# EAGLE design schematic (EAGLE 9.2.2)
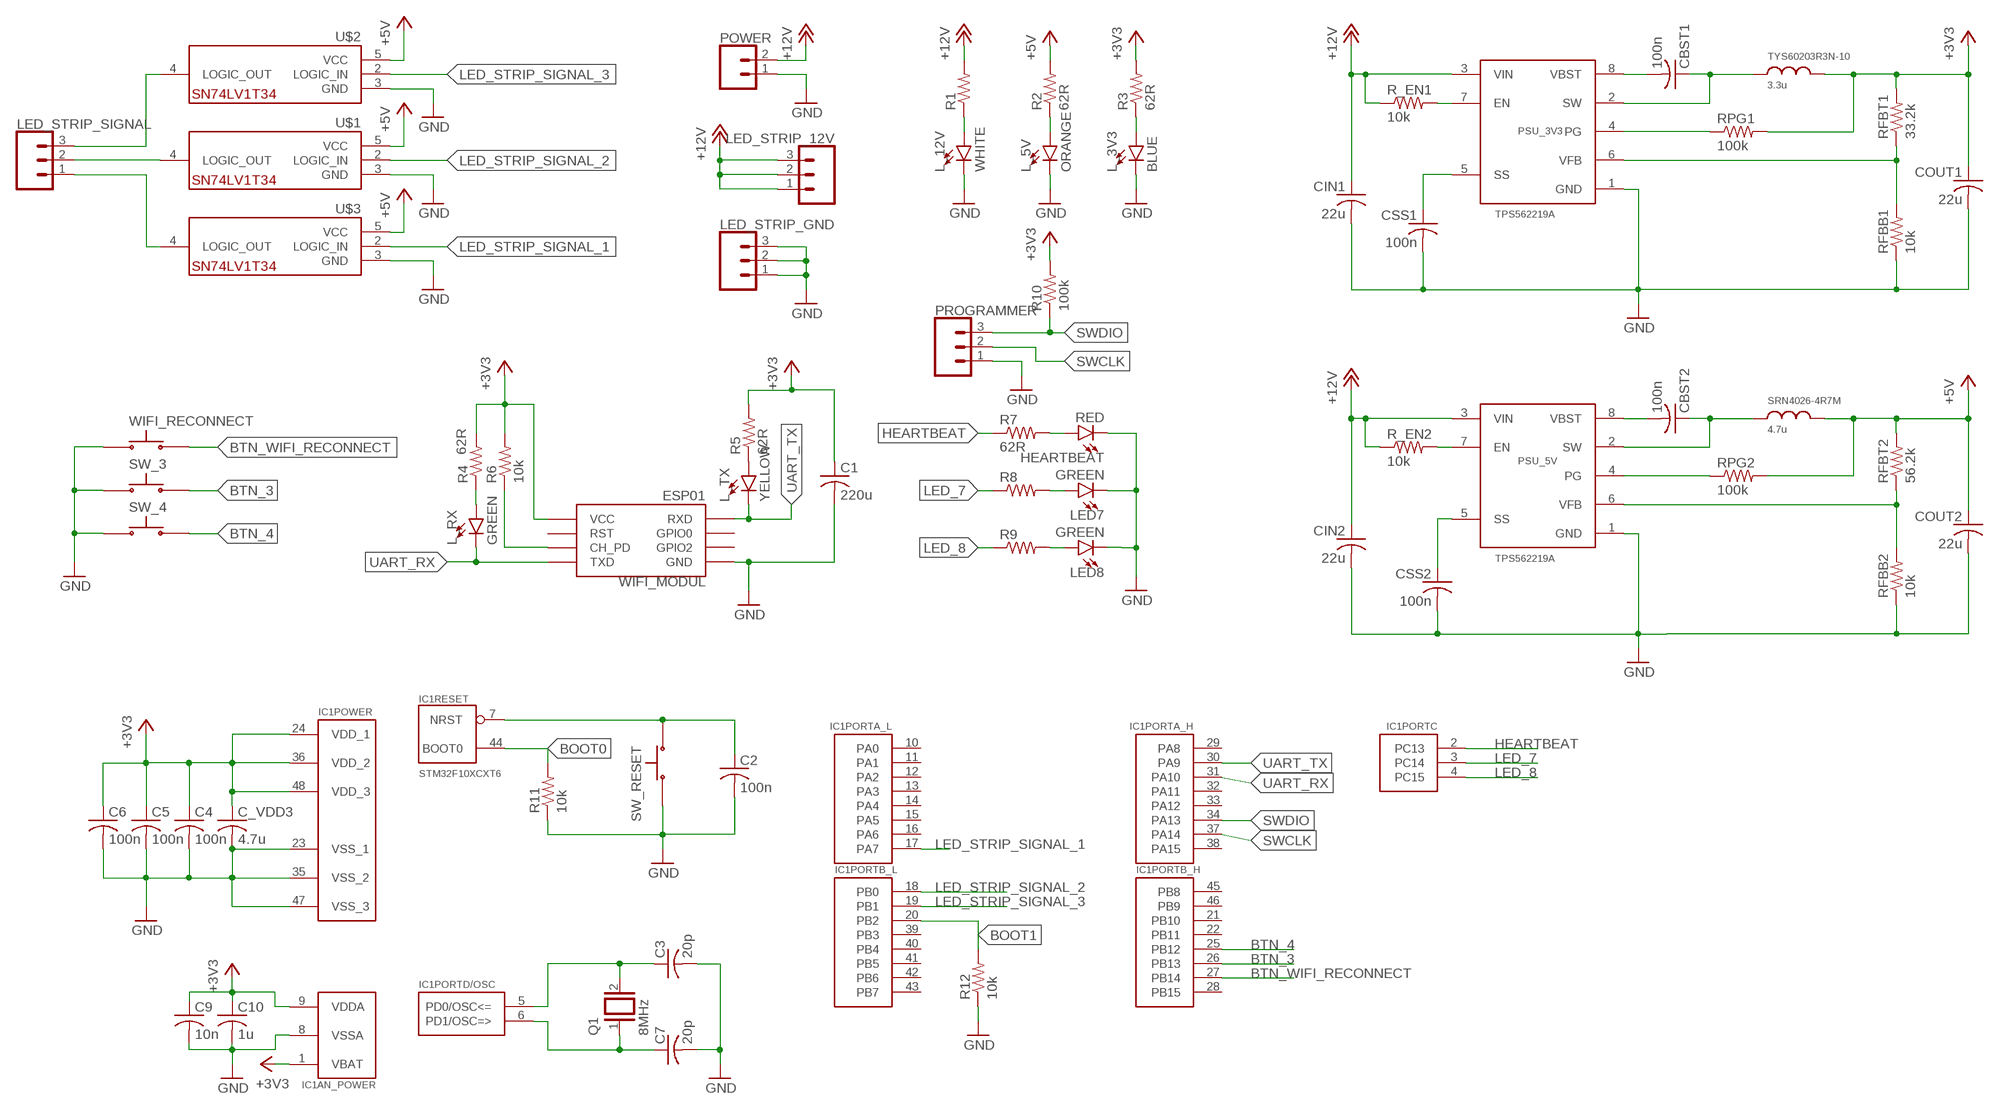
[diagram p0: schematic, sheet 1]

## Parts
C1  220u  C-USC1206  [C1206]
C2  100n  C-USC1206  [C1206]
C3  20p  C-USC1206  [C1206]
C4  100n  C-USC1206  [C1206]
C5  100n  C-USC1206  [C1206]
C6  100n  C-USC1206  [C1206]
C7  20p  C-USC1206  [C1206]
C9  10n  C-USC1206  [C1206]
C10  1u  C-USC1206  [C1206]
C_VDD3  4.7u  C-USC1206  [C1206]
CBST1  100n  C-USC1206  [C1206]
CBST2  100n  C-USC1206  [C1206]
CIN1  22u  C-USC1206  [C1206]
CIN2  22u  C-USC1206  [C1206]
COUT1  22u  C-USC1206  [C1206]
COUT2  22u  C-USC1206  [C1206]
CSS1  100n  C-USC1206  [C1206]
CSS2  100n  C-USC1206  [C1206]
HEARTBEAT  RED  LED-GREEN1206  [LED-1206]
IC1  STM32F10XCXT6  [TQFP48]
L_3V3  BLUE  LED-GREEN1206  [LED-1206]
L_5V  ORANGE  LED-GREEN1206  [LED-1206]
L_12V  WHITE  LED-GREEN1206  [LED-1206]
L_RX  GREEN  LED-GREEN1206  [LED-1206]
L_TX  YELLOW  LED-GREEN1206  [LED-1206]
LED7  GREEN  LED-GREEN1206  [LED-1206]
LED8  GREEN  LED-GREEN1206  [LED-1206]
LED_STRIP_12V  CONN_03SCREW  [SCREWTERMINAL-3.5MM-3]
LED_STRIP_GND  CONN_03SCREW  [SCREWTERMINAL-3.5MM-3]
LED_STRIP_SIGNAL  CONN_03SCREW  [SCREWTERMINAL-3.5MM-3]
POWER  CONN_025MM  [SCREWTERMINAL-5MM-2]
PROGRAMMER  CONN_03POLAR  [MOLEX-1X3]
PSU_3V3  TPS562219A  [SOT23-8L]
PSU_5V  TPS562219A  [SOT23-8L]
Q1  8MHz  XTAL/S  [QS]
R1  R-US_R1206  [R1206]
R2  62R  R-US_R1206  [R1206]
R3  62R  R-US_R1206  [R1206]
R4  62R  R-US_R1206  [R1206]
R5  62R  R-US_R1206  [R1206]
R6  10k  R-US_R1206  [R1206]
R7  62R  R-US_R1206  [R1206]
R8  R-US_R1206  [R1206]
R9  R-US_R1206  [R1206]
R10  100k  R-US_R1206  [R1206]
R11  10k  R-US_R1206  [R1206]
R12  10k  R-US_R1206  [R1206]
R_EN1  10k  R-US_R1206  [R1206]
R_EN2  10k  R-US_R1206  [R1206]
RFBB1  10k  R-US_R1206  [R1206]
RFBB2  10k  R-US_R1206  [R1206]
RFBT1  33.2k  R-US_R1206  [R1206]
RFBT2  56.2k  R-US_R1206  [R1206]
RPG1  100k  R-US_R1206  [R1206]
RPG2  100k  R-US_R1206  [R1206]
SRN4026-4R7M  4.7u  SRN4026-4R7M  [SRN4026-4R7M]
SW_3  TACTILE_SWITCH_SIDETACTILE_SWITCH_SIDE  [TACTILE_SWITCH_SIDE]
SW_4  TACTILE_SWITCH_SIDETACTILE_SWITCH_SIDE  [TACTILE_SWITCH_SIDE]
SW_RESET  TACTILE_SWITCH_SIDETACTILE_SWITCH_SIDE  [TACTILE_SWITCH_SIDE]
TYS60203R3N-10  3.3u  TYS60203R3N-10  [TYS60203R3N-10]
U$1  SN74LV1T34  [SOT-23-5]
U$2  SN74LV1T34  [SOT-23-5]
U$3  SN74LV1T34  [SOT-23-5]
WIFI_MODUL  ESP01  [ESP01]
WIFI_RECONNECT  TACTILE_SWITCH_SIDETACTILE_SWITCH_SIDE  [TACTILE_SWITCH_SIDE]

## Nets
+3V3: C1.1 C4.1 C5.1 C6.1 C9.1 C10.1 C_VDD3.1 COUT1.1 IC1.1(AN_POWER:VBAT) IC1.9(AN_POWER:VDDA) IC1.24(POWER:VDD_1) IC1.36(POWER:VDD_2) IC1.48(POWER:VDD_3) R3.2 R4.2 R5.2 R6.2 R10.2 RFBT1.2 RPG1.2 TYS60203R3N-10.P$2 WIFI_MODUL.VCC
+5V: COUT2.1 R2.2 RFBT2.2 RPG2.2 SRN4026-4R7M.P$3 U$1.5(VCC) U$2.5(VCC) U$3.5(VCC)
+12V: CIN1.1 CIN2.1 LED_STRIP_12V.1 LED_STRIP_12V.2 LED_STRIP_12V.3 POWER.2 PSU_3V3.3(VIN) PSU_5V.3(VIN) R1.2 R_EN1.1 R_EN2.1
BOOT0: IC1.44(RESET:BOOT0) R11.2
BOOT1: IC1.20(PORTB_L:PB2) R12.2
BTN_3: IC1.26(PORTB_H:PB13) SW_3.P$5
BTN_4: IC1.25(PORTB_H:PB12) SW_4.P$5
BTN_WIFI_RECONNECT: IC1.27(PORTB_H:PB14) WIFI_RECONNECT.P$5
GND: C1.2 C2.2 C3.2 C4.2 C5.2 C6.2 C7.2 C9.2 C10.2 C_VDD3.2 CIN1.2 CIN2.2 COUT1.2 COUT2.2 CSS1.2 CSS2.2 HEARTBEAT.C IC1.8(AN_POWER:VSSA) IC1.23(POWER:VSS_1) IC1.35(POWER:VSS_2) IC1.47(POWER:VSS_3) L_3V3.C L_5V.C L_12V.C LED7.C LED8.C LED_STRIP_GND.1 LED_STRIP_GND.2 LED_STRIP_GND.3 POWER.1 PROGRAMMER.1 PSU_3V3.1(GND) PSU_5V.1(GND) R11.1 R12.1 RFBB1.1 RFBB2.1 SW_3.P$3 SW_4.P$3 SW_RESET.P$5 U$1.3(GND) U$2.3(GND) U$3.3(GND) WIFI_MODUL.GND WIFI_RECONNECT.P$3
HEARTBEAT: IC1.2(PORTC:PC13) R7.1
LED_7: IC1.3(PORTC:PC14) R8.1
LED_8: IC1.4(PORTC:PC15) R9.1
LED_STRIP_SIGNAL_1: IC1.17(PORTA_L:PA7) U$3.2(LOGIC_IN)
LED_STRIP_SIGNAL_2: IC1.18(PORTB_L:PB0) U$1.2(LOGIC_IN)
LED_STRIP_SIGNAL_3: IC1.19(PORTB_L:PB1) U$2.2(LOGIC_IN)
N$1: LED_STRIP_SIGNAL.3 U$2.4(LOGIC_OUT)
N$2: LED_STRIP_SIGNAL.2 U$1.4(LOGIC_OUT)
N$3: LED_STRIP_SIGNAL.1 U$3.4(LOGIC_OUT)
N$4: L_12V.A R1.1
N$5: L_5V.A R2.1
N$6: L_3V3.A R3.1
N$7: L_RX.A R4.1
N$8: R6.1 WIFI_MODUL.CH_PD
N$9: L_TX.A R5.1
N$10: HEARTBEAT.A R7.2
N$11: LED7.A R8.2
N$12: LED8.A R9.2
N$13: C2.1 IC1.7(RESET:NRST) SW_RESET.P$3
N$14: C3.1 IC1.5(PORTD/OSC:PD0/OSC<=) Q1.2
N$15: C7.1 IC1.6(PORTD/OSC:PD1/OSC=>) Q1.1
N$17: CBST1.2 PSU_3V3.8(VBST)
N$26: CBST1.1 PSU_3V3.2(SW) TYS60203R3N-10.P$1
N$31: CBST2.2 PSU_5V.8(VBST)
N$32: PSU_3V3.6(VFB) RFBB1.2 RFBT1.1
N$33: CBST2.1 PSU_5V.2(SW) SRN4026-4R7M.P$2
N$35: PSU_5V.6(VFB) RFBB2.2 RFBT2.1
N$37: PSU_3V3.7(EN) R_EN1.2
N$38: PSU_5V.7(EN) R_EN2.2
N$PG1: PSU_3V3.4(PG) RPG1.1
N$PG2: PSU_5V.4(PG) RPG2.1
N$SS1: CSS1.1 PSU_3V3.5(SS)
N$SS2: CSS2.1 PSU_5V.5(SS)
SWCLK: IC1.37(PORTA_H:PA14) PROGRAMMER.2
SWDIO: IC1.34(PORTA_H:PA13) PROGRAMMER.3 R10.1
UART_RX: IC1.31(PORTA_H:PA10) L_RX.C WIFI_MODUL.TX(TXD)
UART_TX: IC1.30(PORTA_H:PA9) L_TX.C WIFI_MODUL.RX(RXD)
Unconnected: IC1.10(PORTA_L:PA0) IC1.11(PORTA_L:PA1) IC1.12(PORTA_L:PA2) IC1.13(PORTA_L:PA3) IC1.14(PORTA_L:PA4) IC1.15(PORTA_L:PA5) IC1.16(PORTA_L:PA6) IC1.21(PORTB_H:PB10) IC1.22(PORTB_H:PB11) IC1.28(PORTB_H:PB15) IC1.29(PORTA_H:PA8) IC1.32(PORTA_H:PA11) IC1.33(PORTA_H:PA12) IC1.38(PORTA_H:PA15) IC1.39(PORTB_L:PB3) IC1.40(PORTB_L:PB4) IC1.41(PORTB_L:PB5) IC1.42(PORTB_L:PB6) IC1.43(PORTB_L:PB7) IC1.45(PORTB_H:PB8) IC1.46(PORTB_H:PB9) WIFI_MODUL.GPIO0 WIFI_MODUL.GPIO2 WIFI_MODUL.RST

## Library data of the parts
C1-C7 C9 C10 C_VDD3 CBST1 CBST2 CIN1 CIN2 COUT1 COUT2 CSS1 CSS2 = rcl:C-US: CAPACITOR, American symbol; SPICEPREFIX: C
HEARTBEAT L_3V3 L_5V L_12V L_TX = SparkFun-LED:LED-GREEN: Green SMD LED Used in manufacturing of various products at SparkFun Packages: 0603 - SMD 0603 package [Product Link] <http://www.futureelectronics.com/en/technologies/semiconductors/optoelectronics/leds/Pages/9894312-LTST-C190GKT.aspx?CrossPart=HSMG-C190&IM=0> LilyPad 1206 - SMD1206 LilyPad package [Product Link] <http://www.futureelectronics.com/en/Technologies/Product.aspx?ProductID=IN150NGHARVATEKCORPORATION2049943&IM=0> 1206 - SMD1206 package [Product Link] <http://www.futureelectronics.com/en/technologies/semiconductors/optoelectronics/leds/Pages/8315665-LTST-C150KGKT.aspx?IM=0> 1206 Bottom Mount -SMD 1206 Bottom Mount [Product Link] <http://www.digikey.com/product-detail/en/lite-on-inc/LTST-C230KGKT/160-1456-1-ND/386854> SparkFun Products: Pro Mini 328 -5V <https://www.sparkfun.com/products/821> RedBoard <https://www.sparkfun.com/products/12757> MP3 Trigger <https://www.sparkfun.com/products/13720> Makey Makey <https://www.sparkfun.com/products/11076>; PROD_ID: DIO-00862; VALUE: GREEN
IC1 = stm32:STM32F10XCXT6: ST STM32F101/103 48pin LQFP
L_RX LED7 LED8 = SparkFun-LED:LED-GREEN: Green SMD LED Used in manufacturing of various products at SparkFun Packages: 0603 - SMD 0603 package [Product Link] <http://www.futureelectronics.com/en/technologies/semiconductors/optoelectronics/leds/Pages/9894312-LTST-C190GKT.aspx?CrossPart=HSMG-C190&IM=0> LilyPad 1206 - SMD1206 LilyPad package [Product Link] <http://www.futureelectronics.com/en/Technologies/Product.aspx?ProductID=IN150NGHARVATEKCORPORATION2049943&IM=0> 1206 - SMD1206 package [Product Link] <http://www.futureelectronics.com/en/technologies/semiconductors/optoelectronics/leds/Pages/8315665-LTST-C150KGKT.aspx?IM=0> 1206 Bottom Mount -SMD 1206 Bottom Mount [Product Link] <http://www.digikey.com/product-detail/en/lite-on-inc/LTST-C230KGKT/160-1456-1-ND/386854> SparkFun Products: Pro Mini 328 -5V <https://www.sparkfun.com/products/821> RedBoard <https://www.sparkfun.com/products/12757> MP3 Trigger <https://www.sparkfun.com/products/13720> Makey Makey <https://www.sparkfun.com/products/11076>; PROD_ID: DIO-00862
LED_STRIP_12V LED_STRIP_GND LED_STRIP_SIGNAL = SparkFun-Connectors:CONN_03: Multi connection point. Often used as Generic Header-pin footprint for 0.1 inch spaced/style header connections On any of the 0.1 inch spaced packages, you can populate with these: Break Away Headers - Straight <https://www.sparkfun.com/products/116> (PRT-00116) Break Away Male Headers - Right Angle <https://www.sparkfun.com/products/553> (PRT-00553) Female Headers <https://www.sparkfun.com/products/115> (PRT-00115) Break Away Headers - Machine Pin <https://www.sparkfun.com/products/117> (PRT-00117) Break Away Female Headers - Swiss Machine Pin <https://www.sparkfun.com/products/743> (PRT-00743) Stackable Header - 3 Pin (Female, 0.1") <https://www.sparkfun.com/products/13875> (PRT-13875) For SCREWTERMINALS and SPRING TERMINALS visit here: Screw Terimnals on SparkFun.com <https://www.sparkfun.com/search/results?term=Screw+Terminals> (5mm/3.5mm/2.54mm spacing) This device is also useful as a general connection point to wire up your design to another part of your project. Our various solder wires solder well into these plated through hole pads. Hook-Up Wire - Assortment (Stranded, 22 AWG) <https://www.sparkfun.com/products/11375> (PRT-11375) Hook-Up Wire - Assortment (Solid Core, 22 AWG) <https://www.sparkfun.com/products/11367> (PRT-11367) View the entire wire category on our website here <https://www.sparkfun.com/categories/141> Special notes: Molex polarized connector foot print use with SKU : PRT-08232 with associated crimp pins and housings.; PROD_ID: CONN-08288; SF_ID: PRT-08235
POWER = SparkFun-Connectors:CONN_02: Multi connection point. Often used as Generic Header-pin footprint for 0.1 inch spaced/style header connections On any of the 0.1 inch spaced packages, you can populate with these: Break Away Headers - Straight <https://www.sparkfun.com/products/116> (PRT-00116) Break Away Male Headers - Right Angle <https://www.sparkfun.com/products/553> (PRT-00553) Female Headers <https://www.sparkfun.com/products/115> (PRT-00115) Break Away Headers - Machine Pin <https://www.sparkfun.com/products/117> (PRT-00117) Break Away Female Headers - Swiss Machine Pin <https://www.sparkfun.com/products/743> (PRT-00743) For SCREWTERMINALS and SPRING TERMINALS visit here: Screw Terimnals on SparkFun.com <https://www.sparkfun.com/search/results?term=Screw+Terminals> (5mm/3.5mm/2.54mm spacing) This device is also useful as a general connection point to wire up your design to another part of your project. Our various solder wires solder well into these plated through hole pads. Hook-Up Wire - Assortment (Stranded, 22 AWG) <https://www.sparkfun.com/products/11375> (PRT-11375) Hook-Up Wire - Assortment (Solid Core, 22 AWG) <https://www.sparkfun.com/products/11367> (PRT-11367) View the entire wire category on our website here <https://www.sparkfun.com/categories/141> Special notes: Molex polarized connector foot print use with: PRT-08233 with associated crimp pins and housings. 2.54_SCREWTERM for use with PRT-10571. 3.5mm Screw Terminal footprints for PRT-08084 5mm Screw Terminal footprints for use with PRT-08432; SF_SKU: PRT-08432
PROGRAMMER = SparkFun-Connectors:CONN_03: Multi connection point. Often used as Generic Header-pin footprint for 0.1 inch spaced/style header connections On any of the 0.1 inch spaced packages, you can populate with these: Break Away Headers - Straight <https://www.sparkfun.com/products/116> (PRT-00116) Break Away Male Headers - Right Angle <https://www.sparkfun.com/products/553> (PRT-00553) Female Headers <https://www.sparkfun.com/products/115> (PRT-00115) Break Away Headers - Machine Pin <https://www.sparkfun.com/products/117> (PRT-00117) Break Away Female Headers - Swiss Machine Pin <https://www.sparkfun.com/products/743> (PRT-00743) Stackable Header - 3 Pin (Female, 0.1") <https://www.sparkfun.com/products/13875> (PRT-13875) For SCREWTERMINALS and SPRING TERMINALS visit here: Screw Terimnals on SparkFun.com <https://www.sparkfun.com/search/results?term=Screw+Terminals> (5mm/3.5mm/2.54mm spacing) This device is also useful as a general connection point to wire up your design to another part of your project. Our various solder wires solder well into these plated through hole pads. Hook-Up Wire - Assortment (Stranded, 22 AWG) <https://www.sparkfun.com/products/11375> (PRT-11375) Hook-Up Wire - Assortment (Solid Core, 22 AWG) <https://www.sparkfun.com/products/11367> (PRT-11367) View the entire wire category on our website here <https://www.sparkfun.com/categories/141> Special notes: Molex polarized connector foot print use with SKU : PRT-08232 with associated crimp pins and housings.; PROD_ID: CONN-08625; SF_ID: PRT-08096
PSU_3V3 PSU_5V = mylibrary:TPS562219A
Q1 = special:XTAL/S: CRYSTAL
R1-R12 R_EN1 R_EN2 RFBB1 RFBB2 RFBT1 RFBT2 RPG1 RPG2 = rcl:R-US_: RESISTOR, American symbol; SPICEPREFIX: R
SRN4026-4R7M = mylibrary:SRN4026-4R7M
SW_3 SW_4 SW_RESET WIFI_RECONNECT = mylibrary:TACTILE_SWITCH_SIDE
TYS60203R3N-10 = mylibrary:TYS60203R3N-10
U$1 U$3 = mylibrary:SN74LV1T34
U$2 = mylibrary:SN74LV1T34; SPICEPREFIX: U
WIFI_MODUL = esp8266modules:ESP01: ESP8266 Wifi module 01

## Board
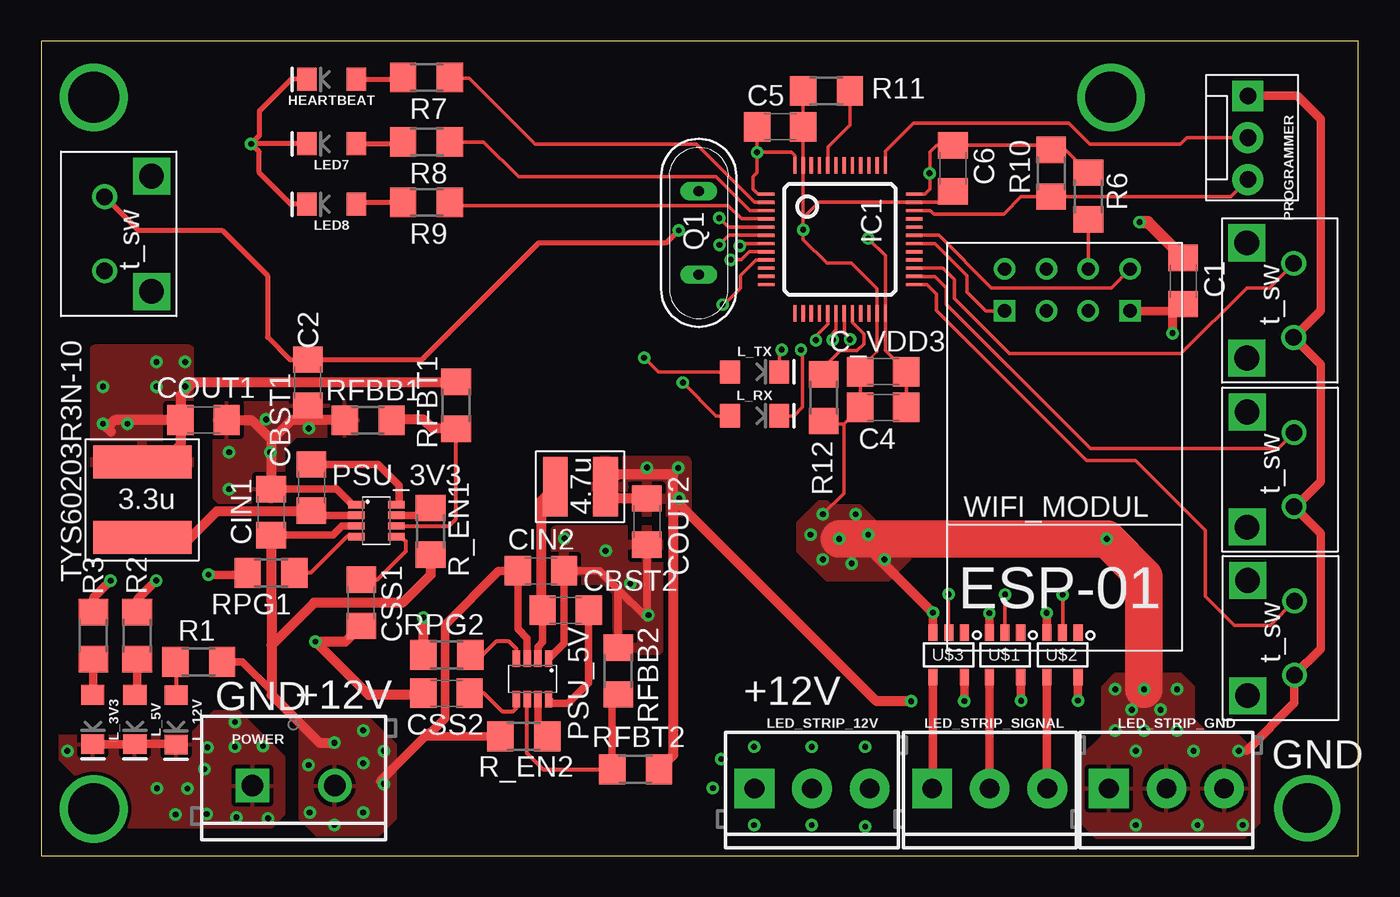
[diagram p1: board, top side]
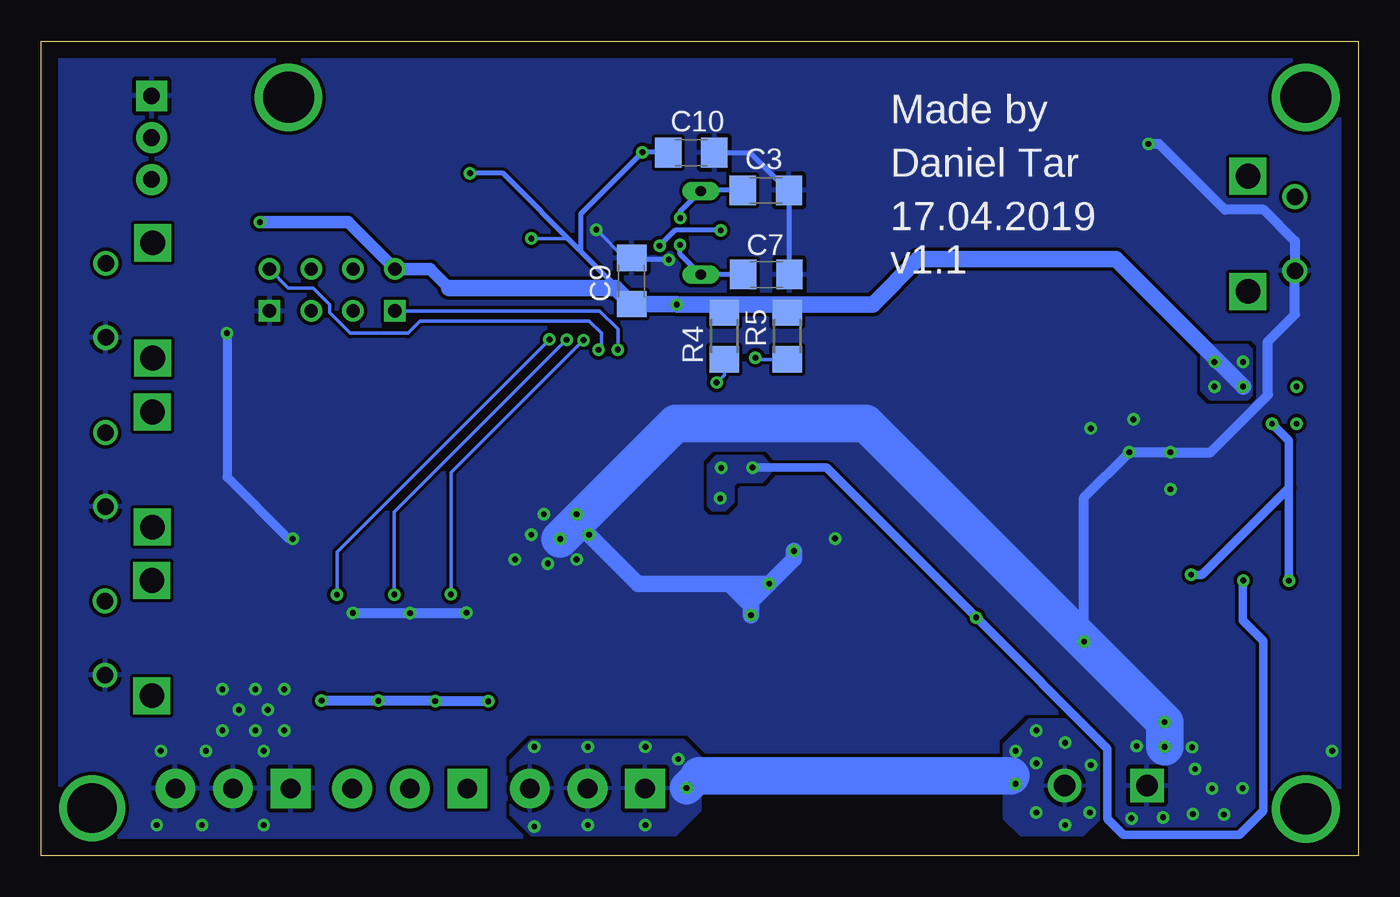
[diagram p2: board, bottom side, seen from below]

Size 80.04 x 49.5 mm. Coordinates in mm from the lower left corner, seen from the top.
Outline: 0,0 80.04,0 80.04,49.5 0,49.5 0,0
Copper layers (1*16): Top 0.035mm / dielectric 1.5mm / Bottom 0.035mm
Design rules "default": minimum track width 6mil, minimum drill 0.35mm, track to track 6mil, track to pad 6mil, pad to pad 6mil, via to via 6mil, smd to smd 6mil, copper to edge 40mil, drill to drill 6mil, minimum pad ring 10mil, minimum via ring 8mil, stop-mask expansion 4mil, vias tented up to drill 0mil, thermal gap 10mil

### Footprints (pad centres in the part's own frame; a part is rotated, then mirrored left to right if it is on the bottom)
C1206 = smd 1.6 x 1.8: 1 -1.4,0; 2 1.4,0
LED-1206 = smd 1.2 x 1.4: A -1.5,0; C 1.5,0
TQFP48 = smd 0.2 x 1: 1 -2.75,-4.5; 2 -2.25,-4.5; 3 -1.75,-4.5; 4 -1.25,-4.5; 5 -0.75,-4.5; 6 -0.25,-4.5; 7 0.25,-4.5; 8 0.75,-4.5; 9 1.25,-4.5; 10 1.75,-4.5; 11 2.25,-4.5; 12 2.75,-4.5; 25 2.75,4.5; 26 2.25,4.5; 27 1.75,4.5; 28 1.25,4.5; 29 0.75,4.5; 30 0.25,4.5; 31 -0.25,4.5; 32 -0.75,4.5; 33 -1.25,4.5; 34 -1.75,4.5; 35 -2.25,4.5; 36 -2.75,4.5 | smd 1 x 0.2: 13 4.5,-2.75; 14 4.5,-2.25; 15 4.5,-1.75; 16 4.5,-1.25; 17 4.5,-0.75; 18 4.5,-0.25; 19 4.5,0.25; 20 4.5,0.75; 21 4.5,1.25; 22 4.5,1.75; 23 4.5,2.25; 24 4.5,2.75; 37 -4.5,2.75; 38 -4.5,2.25; 39 -4.5,1.75; 40 -4.5,1.25; 41 -4.5,0.75; 42 -4.5,0.25; 43 -4.5,-0.25; 44 -4.5,-0.75; 45 -4.5,-1.25; 46 -4.5,-1.75; 47 -4.5,-2.25; 48 -4.5,-2.75
SCREWTERMINAL-3.5MM-3 = drill 1.2 pad 2.413 square: 1 0,0 | drill 1.2 pad 2.413: 2 3.5,0; 3 7,0
SCREWTERMINAL-5MM-2 = drill 1.3 pad 2.032 square: 1 0,0 | drill 1.3 pad 2.032: 2 5,0
MOLEX-1X3 = drill 1.016 pad 1.88 square: 1 0,0 | drill 1.016 pad 1.88: 2 2.54,0; 3 5.08,0
SOT23-8L = smd 0.45 x 1: 1 -0.975,-1.225; 2 -0.325,-1.225; 3 0.325,-1.225; 4 0.975,-1.225; 5 0.975,1.225; 6 0.325,1.225; 7 -0.325,1.225; 8 -0.975,1.225
QS = drill 0.61 long: 1 -2.54,0; 2 2.54,0
R1206 = smd 1.6 x 1.803: 1 -1.422,0; 2 1.422,0
SRN4026-4R7M = smd 1.5 x 3.6: P$2 3.05,0; P$3 0,0
TACTILE_SWITCH_SIDE = drill 1.5 square: P$1 -3.5,0; P$2 3.5,0 | drill 1: P$3 -2.25,-2.85; P$5 2.25,-2.85
TYS60203R3N-10 = smd 2 x 6: P$1 -2.3,0; P$2 2.3,0
SOT-23-5 = smd 1 x 0.55: 1 -1.35,0.95; 2 -1.35,0; 3 -1.35,-0.95; 4 1.35,-0.95; 5 1.35,0.95
ESP01 = drill 0.8: CH_PD -1.285,-8.178; GPIO0 1.255,-5.638; GPIO2 -1.285,-5.638; RST 1.255,-8.178; TX -3.825,-8.178; VCC 3.795,-8.178 | drill 0.8 square: GND -3.825,-5.638; RX 3.795,-5.638

### Placement (x,y rotation side)
C1  69.4,34.92 270 top
C2  16.2,28.75 270 top
C3  36,40.43 0 bottom
C4  51.17,27.24 180 top
C5  44.91,44.29 0 top
C6  55.4,41.77 270 top
C7  35.97,35.32 0 bottom
C9  44.16,34.92 90 bottom
C10  40.53,42.72 0 bottom
C_VDD3  51.17,29.41 180 top
CBST1  16.43,22.37 90 top
CBST2  31.87,14.91 0 top
CIN1  13.98,20.87 90 top
CIN2  30.37,17.31 0 top
COUT1  9.87,26.47 0 top
COUT2  36.81,20.3 270 top
CSS1  19.45,15.36 270 top
CSS2  24.63,9.87 180 top
HEARTBEAT  17.65,47.18 180 top
IC1  48.55,37.45 270 top
L_3V3  3.14,8.27 270 top
L_5V  5.7,8.27 270 top
L_12V  8.2,8.25 270 top
L_RX  43.35,26.73 0 top
L_TX  43.35,29.4 0 top
LED7  17.65,43.26 180 top
LED8  17.65,39.59 180 top
LED_STRIP_12V  43.34,4.08 0 top
LED_STRIP_GND  64.88,4.08 0 top
LED_STRIP_SIGNAL  54.14,4.08 0 top
POWER  12.84,4.25 0 top
PROGRAMMER  73.33,46.17 270 top
PSU_3V3  20.37,20.36 270 top
PSU_5V  29.86,10.74 180 top
Q1  39.96,37.85 90 top
R1  9.58,11.77 0 top
R2  5.84,13.37 90 top
R3  3.17,13.37 90 top
R4  38.53,31.58 90 bottom
R5  34.7,31.58 90 bottom
R6  63.63,40.08 90 top
R7  23.42,47.29 180 top
R8  23.42,43.37 180 top
R9  23.42,39.7 180 top
R10  61.38,41.47 90 top
R11  47.72,46.47 0 top
R12  47.55,27.84 90 top
R_EN1  23.66,19.71 90 top
R_EN2  29.33,7.25 0 top
RFBB1  19.87,26.46 0 top
RFBB2  35.06,11.22 270 top
RFBT1  25.21,27.37 90 top
RFBT2  36.12,5.24 0 top
RPG1  13.97,17.18 180 top
RPG2  24.65,12.19 180 top
SRN4026-4R7M  34.29,22.42 180 top
SW_3  73.28,23.46 90 top
SW_4  73.31,13.22 90 top
SW_RESET  6.71,37.79 270 top
TYS60203R3N-10  6.15,21.63 90 top
U$1  58.57,12.2 270 top
U$2  62.06,12.19 270 top
U$3  55.15,12.2 270 top
WIFI_MODUL  62.34,27.47 180 top
WIFI_RECONNECT  73.26,33.74 90 top

### Tracks (layer width: path | path; a pad name or v marks a point on that pad's centre or on a via)
+3V3  (via drill 0.35)
  Top 0.152: 52.57,29.43 C_VDD3.1
  Top 0.203: IC1.9 43.45,36.2 42.5,35.25 42.5,34.5 41.49,33.49 v41.41,33.49 | 52.57,29.43 51.3,30.7 IC1.24 51.3,36.45 v50.25,37.5 | C_VDD3.1 C4.1 | IC1.1 43.55,40.2 43.25,40.5 43.25,41.25 43.51,41.51 43.51,42.25 43.5,42.26 v43.5,42.75 | IC1.48 45.8,42.55 45.6,42.75 v43.5,42.75 | C5.1 v43.5,42.75 | IC1.36 53.7,40.2 54,40.5 54,41.45 v53.98,41.47 54,41.49 54,42.75 54.42,43.17 C6.1 61.1,43.17 R10.2 62.24,42.89 R6.2
  Top 0.508: v4.22,16.71 3.17,15.66 R3.2 | v10.16,17.07 12.44,17.07 RPG1.2
  Top 0.61: COUT1.1 8.47,24.97 7.43,23.93 TYS60203R3N-10.P$2 | COUT1.1 4.47,26.47 4,26 4.25,25.75 | RFBT1.2 25.17,28.75 9.25,28.75 8.47,27.97 COUT1.1
  Top 0.762: v66.75,38.5 67.25,38.5 69.4,36.35 C1.1
  Bottom 0.203: v50.25,37.5 48,37.5 47.25,36.75
  Bottom 0.305: v41.41,33.49 43.99,33.49 47.25,36.75 | v53.98,41.47 51.97,41.47 47.25,36.75 | C10.1 41.96,42.75 v43.5,42.75 47.25,39 47.25,36.75 | R5.2 34.7,33.44 34.75,33.49 | R4.2 38.53,33.46 38.5,33.49
  Bottom 0.508: v4.22,16.71 4.22,22.35 | 4.22,22.35 4.22,25.22 v5.25,26.25 | 4.22,22.35 9.5,17.07 v10.16,17.07
  Bottom 0.762: 55.25,34.5 56.4,35.65 WIFI_MODUL.VCC 61.4,38.5 v66.75,38.5
  Bottom 1.016: v7,28.5 14.75,36.25 26.75,36.25 29.51,33.49 34.75,33.49 38.5,33.49 v41.41,33.49 41.44,33.52 C9.1 45.14,34.5 55.25,34.5
  other vias: 8.75,28.5 3.75,28.5 3.75,26.25 7,30 8.75,30
  pour Top: 3.5,23.25 9,23.25 9,30.75 3.25,30.75 3.25,23.25
  pour Bottom (isolate 0.203): 6.5,28 6.75,27.75 9,27.75 9.5,28.25 9.5,29 9.5,31 6.75,31 6.5,30.75
+5V  (via drill 0.35)
  Top 0.508: U$2.5 v63.01,9.43 v63,9.42 | U$1.5 59.52,9.44 v59.55,9.41 | U$3.5 v56.1,9.39 | v6.99,16.72 5.84,15.57 R2.2
  Top 0.61: 38.4,21.75 38.4,6.1 RFBT2.2 | 38.4,21.75 38.4,23.17 35.04,23.17 SRN4026-4R7M.P$3 35.01,21.7 COUT2.1 | v52.86,9.38 50.77,9.38 38.4,21.75 | RPG2.2 v23.23,14.46 v23.22,14.47
  Bottom 0.508: v36.81,23.58 32.33,23.58 v23.22,14.47 15.25,6.5 15.25,2.23 14.29,1.27 7.23,1.27 5.78,2.72 5.78,13.04 7.03,14.29 7.03,16.68 v6.99,16.72
  Bottom 0.61: v52.86,9.38 v52.87,9.39 v56.1,9.39 59.53,9.39 v59.55,9.41 v62.99,9.41 v63,9.42
  other vias: 38.77,21.71 38.71,23.56
  pour Top: 33.75,24 39.2,24 39.2,20.88 33.75,20.88
  pour Bottom (isolate 0.203): 36.25,24.25 39,24.25 39.5,23.75 39.5,21.25 39.25,21 38.5,21 38,21.5 38,22.5 37.75,22.75 36.25,22.75 35.75,23.25 35.75,23.75
+12V  (via drill 0.35)
  Top 0.152: 28.97,17.25 CIN2.1
  Top 0.457: PSU_5V.3 29.54,13.21 28.97,13.78 28.97,17.25 | R1.2 12.23,11.77 14,10 14,9.75 | PSU_3V3.3 18.29,20.04 17.75,19.5 14.01,19.5 CIN1.1
  Top 0.508: CIN2.1 27.81,17.31 24.54,14.04 24.54,8.35 23.68,7.5 | 23.68,7.5 23.43,7.25 R_EN2.1 | 20.59,4.5 23.59,7.5 23.68,7.5
  Top 0.61: R_EN1.1 23.66,17.07 21.96,15.36 16.58,15.36 14,12.78 | 14,12.78 14,15.5 13.98,15.52 CIN1.1 | 14,12.78 14,9.75 14.02,9.75 16.91,6.86 v17.82,6.86
  Bottom 2.032: v40.82,4.11 40.07,4.86
  Bottom 2.286: 40.07,4.86 21.11,4.86
  other vias: 16.25,5.5 19.57,5.61 20.82,4.36 20.82,6.36 41.32,5.86 43.32,6.61 46.82,6.61 50.07,6.61 50.07,1.76 46.82,1.86 43.32,1.86 19.57,2.61 17.82,1.86 16.32,2.61 19.57,7.61
  pour Top: 16.75,1.25 15.75,2.25 15.75,8 16,8.25 20,8.25 21.5,6.75 21.5,2.25 20.5,1.25
  pour Bottom: 51.5,5.75 51.5,2.5 50.25,1.25 41.5,1.25 40,2.75 40,4.75 40,6 41,7 50.25,7
  pour Bottom (isolate 0.203): 16.75,1.25 15.75,2.25 15.75,7.75 15.75,8 16,8.25 20,8.25 21.5,6.75 21.5,2.25 20.5,1.25
BOOT0
  Top 0.203: IC1.44 47.8,43.05 49.14,44.39 R11.2
BOOT1
  Top 0.203: IC1.20 49.3,32.39 49.99,31.7 49.99,31.09 49.58,30.68 48.56,30.68 47.55,29.67 R12.2
BTN_3
  Top 0.203: IC1.26 54.3,35.2 55,34.5 55,33.5 63.75,24.75 75.17,24.75 SW_3.P$5
BTN_4
  Top 0.203: IC1.25 53.83,34.7 54.39,34.14 54.39,33.11 63.5,24 66.5,24 70.75,19.75 70.75,15.75 72.5,14 74.69,14 SW_4.P$5
BTN_WIFI_RECONNECT
  Top 0.203: IC1.27 54.8,35.7 55.5,35 55.5,33.84 58.84,30.5 69.25,30.5 73.25,34.5 74.62,34.5 WIFI_RECONNECT.P$5
GND  (via drill 0.35)
  Top 0.152: 50.8,30.64 49.77,29.61 C_VDD3.2 | 32,17.31 CIN2.2
  Top 0.203: IC1.8 43.03,36.7 42.56,36.23 v41.91,36.23 v41.9,36.22 | 50.8,30.64 IC1.23 50.8,34.45 49.25,36 47.75,36 46.3,37.45 v46.3,38.04 46.3,38.75 | C_VDD3.2 C4.2 48.77,26.23 | 46.3,44.25 IC1.47 46.3,38.75 | 46.3,44.25 C5.2 | C6.2 54.73,39.7 IC1.35 47.25,39.7 46.3,38.75 | R11.1 46.3,44.25 | 73.25,6.36 v72.77,6.36 | 76.17,21.17 SW_3.P$3 77.75,22.83 | v47.5,20.75 48.77,22.02 48.77,26.23 | R12.1 47.73,26.23 48.77,26.23
  Top 0.305: HEARTBEAT.C 15.18,47.18 13.25,45.25 13.25,43.75 v12.76,43.26 | LED7.C v12.76,43.26 | LED8.C 15.16,39.59 13.25,41.5 13.25,42.77 v12.76,43.26
  Top 0.457: CIN2.2 31.77,12.9 PSU_5V.1 | 35.06,16.19 RFBB2.1 | 35.06,16.19 36.81,14.44 COUT2.2 | 32,17.31 33.94,17.31 35.06,16.19 | CIN1.2 17.96,22.27 18.89,21.34 PSU_3V3.1 | 13.98,25.23 14,25.25 15.21,26.46
  Top 0.508: v54.19,14.76 v54.2,14.75 U$3.3 | v57.62,14.73 U$1.3 | v61.1,14.75 U$2.3 | L_3V3.C L_5V.C 5.72,6.79 8.16,6.79 L_12V.C | C1.2 68.99,33.11 WIFI_MODUL.GND | 73.25,6.36 76.16,9.27 SW_4.P$3 77.75,12.56 77.75,19.59 76.17,21.17 77.75,22.75 77.75,22.83 77.75,29.85 WIFI_RECONNECT.P$3 77.75,33.13 77.75,44.75 76.33,46.17 PROGRAMMER.1
  Top 0.559: C1.2 68.75,32.87 v68.75,31.75
  Top 0.61: COUT1.2 12.78,26.47 14,25.25 | CIN1.2 13.98,25.23 15.21,26.46 RFBB1.1 | v54.19,14.76 49.7,19.25 v48.5,19.25 | CSS2.2 23.12,9.75 19.91,9.75 16.67,13 | 16.67,13 v16.67,13.01 | CSS1.2 18.48,13 16.67,13
  Top 2.286: v67.02,10.11 67.02,16.98 v64.75,19.25 v48.5,19.25
  Bottom 0.203: v46.3,38.04 44.58,36.32 C9.2
  Bottom 0.305: C10.2 36.97,42.72 35.25,41 35.17,41 C3.2 34.6,35.35 C7.2 | v41.9,36.22 44.06,36.22 C9.2
  Bottom 0.559: v68.75,31.75 68.75,23 65,19.25 v64.75,19.25
  Bottom 0.61: v16.67,13.01 16.67,21.76 v13.92,24.51 v11.42,24.51 8.99,24.51 5.5,28 5.5,31.25 3.86,32.89 SW_RESET.P$5 3.86,37.36 5.75,39.25 8.11,39.25 12.12,43.26 v12.76,43.26 | v54.19,14.76 54.22,14.73 v57.62,14.73 61.08,14.73 v61.1,14.75
  Bottom 1.016: v35.8,16.52 38.25,16.52 | 38.25,16.52 43.77,16.52 v46.75,19.5 | 38.25,16.52 36.9,15.17 v36.9,14.61 36.9,15.42 v35.8,16.52 | v35.8,16.52 34.3,18.02 v34.3,18.52
  Bottom 2.286: v48.5,19.25 41.5,26.25 29.91,26.25 v16.67,13.01 v11.77,8.11 v11.77,6.61
  other vias: 11.42,22.26 16.26,25.96 13.67,26.51 13.48,6.65 10.11,6.58 9.92,5.26 8.17,2.5 11.87,2.32 10.06,2.53 8.89,4.08 31.8,19.27 13.79,2.26 1.59,6.36 7.04,4.09 65.27,10.11 69.02,10.11 68.02,8.86 66.27,8.86 65.27,7.61 67.02,7.61 69.02,7.61 70.02,6.36 66.52,1.86 70.27,1.86 66.52,6.36 73.02,1.86 47.5,18 49.25,17.75 51.25,18 49.5,20.75 50.25,19.5
  pour Top: 32.25,16.75 34.25,16.75 35,16 35,12.5 37.5,12.5 37.5,18.25 37.5,19.75 31.25,19.75 31.25,16.75
  pour Top: 14.75,21.75 14.75,24.75 15.5,25.5 19.25,25.5 19.25,27.5 10.5,27.5 10.5,21.75 10.75,21.5 14.5,21.5
  pour Bottom (isolate 0.203): 64.5,7.25 63.25,6 63.25,2.25 63.25,2 64.5,0.75 72.75,0.75 74,2 74,6 72.75,7.25 71,7.25 70,8.25 70,10.25 69.25,11 65.5,11 65.25,11 64.5,10.25
  pour Top (isolate 0.203): 64.5,7.25 63.25,6 63.25,2 64.25,1 73,1 74,2 74,6 72.75,7.25 71,7.25 70,8.25 70,10.25 69.25,11 65.25,11 64.5,10.25 64.5,10
  pour Bottom (isolate 0.203): 47.75,21.5 48,21.25 49.75,21.25 52.75,18.25 52.75,18 51.5,16.75 48.5,16.75 47.75,16.75 46,18.5 46,20.25 47.25,21.5
  pour Top (isolate 0.203): 47.75,21.5 48,21.25 49.75,21.25 52.75,18.25 52.75,18 51.5,16.75 47.75,16.75 46,18.5 46,20.25 47.25,21.5
  pour Bottom (isolate 0.203): 1,6 1,7 1.25,7.25 9,7.25 10.25,8.5 12.25,8.5 14.75,6 14.75,1.75 5.25,1.75
  pour Top (isolate 0.203): 1,6 5.25,1.75 14,1.75 14.75,2.5 14.75,6 12,8.75 10.5,8.75 9,7.25 1,7.25
  pour Bottom (isolate 0.203, rank 2): -0.5,50 -0.5,-0.25 80.25,-0.25 80.5,-0.25 80.5,50
  pour Bottom (isolate 0.203): 14.43,47.14 14.43,37.39 29.26,37.39 29.26,47.14
  pour Bottom: 12.4,27.43 10.57,25.6 10.57,24.79 10.57,22.15 11.18,21.54 12.6,21.54 14.83,23.77 14.83,24.79 15.44,25.4 16.87,25.4 17.27,25.81 17.27,26.42 17.27,27.03 16.87,27.43
  pour Bottom: 31.5,19.91 34.95,19.91 37.59,17.27 37.59,16.87 37.59,14.02 37.19,13.61 35.76,13.61 35.36,14.02 35.36,15.65 35.56,15.85 32.92,18.49 31.5,18.49 31.29,18.69 31.29,19.71
HEARTBEAT
  Top 0.203: R7.1 24.88,47.25 26,47.25 30,43.25 39.81,43.25 43.36,39.7 IC1.2
LED_7
  Top 0.203: IC1.3 43.07,39.2 41.02,41.25 29,41.25 26.88,43.37 R8.1
LED_8
  Top 0.203: R9.1 25.04,39.5 41.75,39.5 42.55,38.7 IC1.4
LED_STRIP_SIGNAL_1  (via drill 0.35)
  Top 0.203: IC1.17 47.8,32.3 47.08,31.58 v47.08,31.33 | v55.14,15.88 U$3.2
  Bottom 0.203: v55.14,15.88 55.14,23.27 v47.08,31.33
LED_STRIP_SIGNAL_2  (via drill 0.35)
  Top 0.203: v58.58,15.87 v58.57,15.86 U$1.2 | IC1.18 48.31,31.96 48.11,31.76 v48.11,31.35
  Bottom 0.203: v58.58,15.87 58.58,20.88 v48.11,31.35
LED_STRIP_SIGNAL_3  (via drill 0.35)
  Top 0.203: IC1.19 48.8,31.72 v49.15,31.37 | v62.07,15.86 U$2.2
  Bottom 0.203: v62.07,15.86 62.05,15.88 62.05,18.47 v49.15,31.37
N$1
  Top 0.508: U$2.4 61.11,4.11 LED_STRIP_SIGNAL.3
N$2
  Top 0.508: U$1.4 57.62,4.1 LED_STRIP_SIGNAL.2
N$3
  Top 0.508: U$3.4 54.2,4.14 LED_STRIP_SIGNAL.1
N$4
  Top 0.254: R1.1 8.2,11.73 L_12V.A
N$5
  Top 0.508: R2.1 5.84,9.91 L_5V.A
N$6
  Top 0.508: R3.1 3.17,9.8 L_3V3.A
N$7  (via drill 0.35)
  Top 0.203: v39,28.75 41.02,26.73 L_RX.A
  Bottom 0.203: R4.1 38.53,29.22 v39,28.75
N$8
  Top 0.203: R6.1 WIFI_MODUL.CH_PD
N$9  (via drill 0.35)
  Top 0.203: L_TX.A 37.5,29.4 v36.64,30.26
  Bottom 0.203: R5.1 36.54,30.16 v36.64,30.26
N$10
  Top 0.305: HEARTBEAT.A 21.89,47.18 R7.2
N$11
  Top 0.305: LED7.A 21.89,43.26 R8.2
N$12
  Top 0.305: LED8.A 19.26,39.7 R9.2
N$13  (via drill 0.35)
  Top 0.203: IC1.7 42.6,37.2 v42.46,37.06
  Top 0.305: SW_RESET.P$3 5.9,38 11,38 13.75,35.25 13.75,31.5 15.1,30.15 C2.1 23.15,30.15 30.25,37.25 38,37.25 v38.75,38
  Bottom 0.305: v38.75,38 41.52,38 v42.46,37.06
N$14  (via drill 0.35)
  Top 0.203: IC1.5 41.76,38.2 v41.21,38.75
  Bottom 0.305: C3.1 39.92,40.43 Q1.2 41.21,39.14 v41.21,38.75
N$15  (via drill 0.35)
  Top 0.203: IC1.6 41.79,37.7 v41.22,37.13 v41.22,37.12
  Bottom 0.203: 41.17,37.08 v41.22,37.12 | Q1.1
  Bottom 0.305: C7.1 Q1.1 | Q1.1 41.21,36.56 41.21,37.04 41.17,37.08
N$17
  Top 0.457: CBST1.2 20.48,23.77 21.75,22.5 21.75,21.49 PSU_3V3.8
N$21  (via drill 3.1)
  other vias: 65.01,46.08
N$26
  Top 0.457: PSU_3V3.2 16.71,20.68 CBST1.1
  Top 0.61: TYS60203R3N-10.P$1 6.23,19.25 9,19.25 10.67,20.92 16.38,20.92 CBST1.1
N$29  (via drill 3)
  other vias: 76.94,2.88
N$31
  Top 0.152: CBST2.2 33.25,14.89 33.25,14.5
  Top 0.457: 33.25,14.5 33.25,10.5 32.02,9.27 31.75,9.27 31.09,9.27 PSU_5V.8
N$32
  Top 0.254: PSU_3V3.6 24.79,20.04 25.21,20.46 RFBT1.1
  Top 0.61: RFBT1.1 23.8,25.95 23.25,26.5 21.33,26.5 RFBB1.2
N$33
  Top 0.457: PSU_5V.2 | PSU_5V.2 30.18,12.69 30.47,12.97 CBST2.1
  Top 0.61: SRN4026-4R7M.P$2 30.38,21.56 30.38,15 CBST2.1
N$35
  Top 0.152: 34,5.24 RFBT2.1
  Top 0.254: PSU_5V.6 29.5,9.48 29.5,6.25 30.51,5.24 34,5.24
  Top 0.457: RFBB2.2 34.7,9.44 RFBT2.1
N$37
  Top 0.457: PSU_3V3.7 23.22,20.68 R_EN1.2
N$38
  Top 0.457: PSU_5V.7 30.18,7.82 R_EN2.2
N$900  (via drill 3.1)
  other vias: 3.2,46.08
N$PG1
  Top 0.254: PSU_3V3.4 18.57,19.39 18.49,19.3 16.37,17.18 RPG1.1
N$PG2
  Top 0.254: PSU_5V.4 28.89,12.57 28.45,13.01 27.64,13.01 26.82,12.19 RPG2.1
N$SS1
  Top 0.254: PSU_3V3.5 21.86,19.39 22.15,19.1 22.15,18.49 20.42,16.76 CSS1.1
N$SS2
  Top 0.254: PSU_5V.5 28.85,9.48 28.85,8.94 28.65,8.74 28.04,8.74 26.91,9.87 CSS2.1
S$2  (via drill 3.1)
  other vias: 3.2,2.83
SWCLK
  Top 0.203: IC1.37 51.3,42.8 53,44.5 62.45,44.5 63.73,43.22 69.21,43.22 69.62,43.63 PROGRAMMER.2
SWDIO
  Top 0.203: IC1.34 54.05,39.2 54.25,39 58.5,39 59.55,40.05 R10.1 72.29,40.05 PROGRAMMER.3
UART_RX  (via drill 0.35)
  Top 0.203: L_RX.C 45.73,26.73 46.25,27.25 46.25,30.66 v46.17,30.74 | IC1.31 54.55,37.7 57.75,34.5 65.02,34.5 WIFI_MODUL.TX
  Bottom 0.203: v46.17,30.74 46,30.91 46,31.75 46.75,32.5 57,32.5 57.75,31.75 61.25,31.75 62.5,33 62.5,33.5 63.5,34.5 65.02,34.5 WIFI_MODUL.TX
UART_TX  (via drill 0.35)
  Top 0.203: L_TX.C 44.85,30.6 v45,30.75 | IC1.30 54.3,37.2 56.25,35.25 56.25,34.25 57.39,33.11 WIFI_MODUL.RX
  Bottom 0.203: v45,30.75 45,32 46.11,33.11 WIFI_MODUL.RX

### Text on the board
tPlace: GND | +12V | +12V | GND
bNames: Made by | Daniel Tar | 17.04.2019 | v1.1